# EAGLE schematic led_schematic (EAGLE 9.0.1)
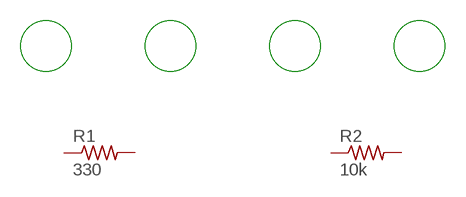
[diagram p0: schematic, sheet 1]

## Parts
R1  330  R-US_0204/2V  [0204V]
R2  10k  R-US_0204/2V  [0204V]
Unconnected: R1.1 R1.2 R2.1 R2.2

## Library data of the parts
R1 R2 = rcl:R-US_: RESISTOR, American symbol; SPICEPREFIX: R